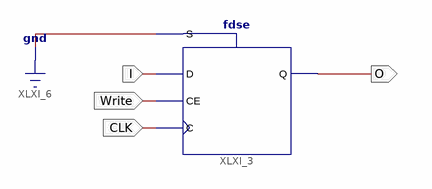
[diagram p0: schematic sheet 1]
// Xilinx ISE schematic IntReg16.sch (spartan3e) as structural Verilog: 1 symbols, 4 ports
module IntReg16 (
  input  I,
  input  Write,
  input  CLK,
  output O
);

  fdse XLXI_3 (.C(CLK), .CE(Write), .D(I), .S(1'b0), .Q(O));
endmodule
